# Altium schematic sheet Sheet2.SchDoc
size A4; SheetNumber: 1; SheetTotal: 1
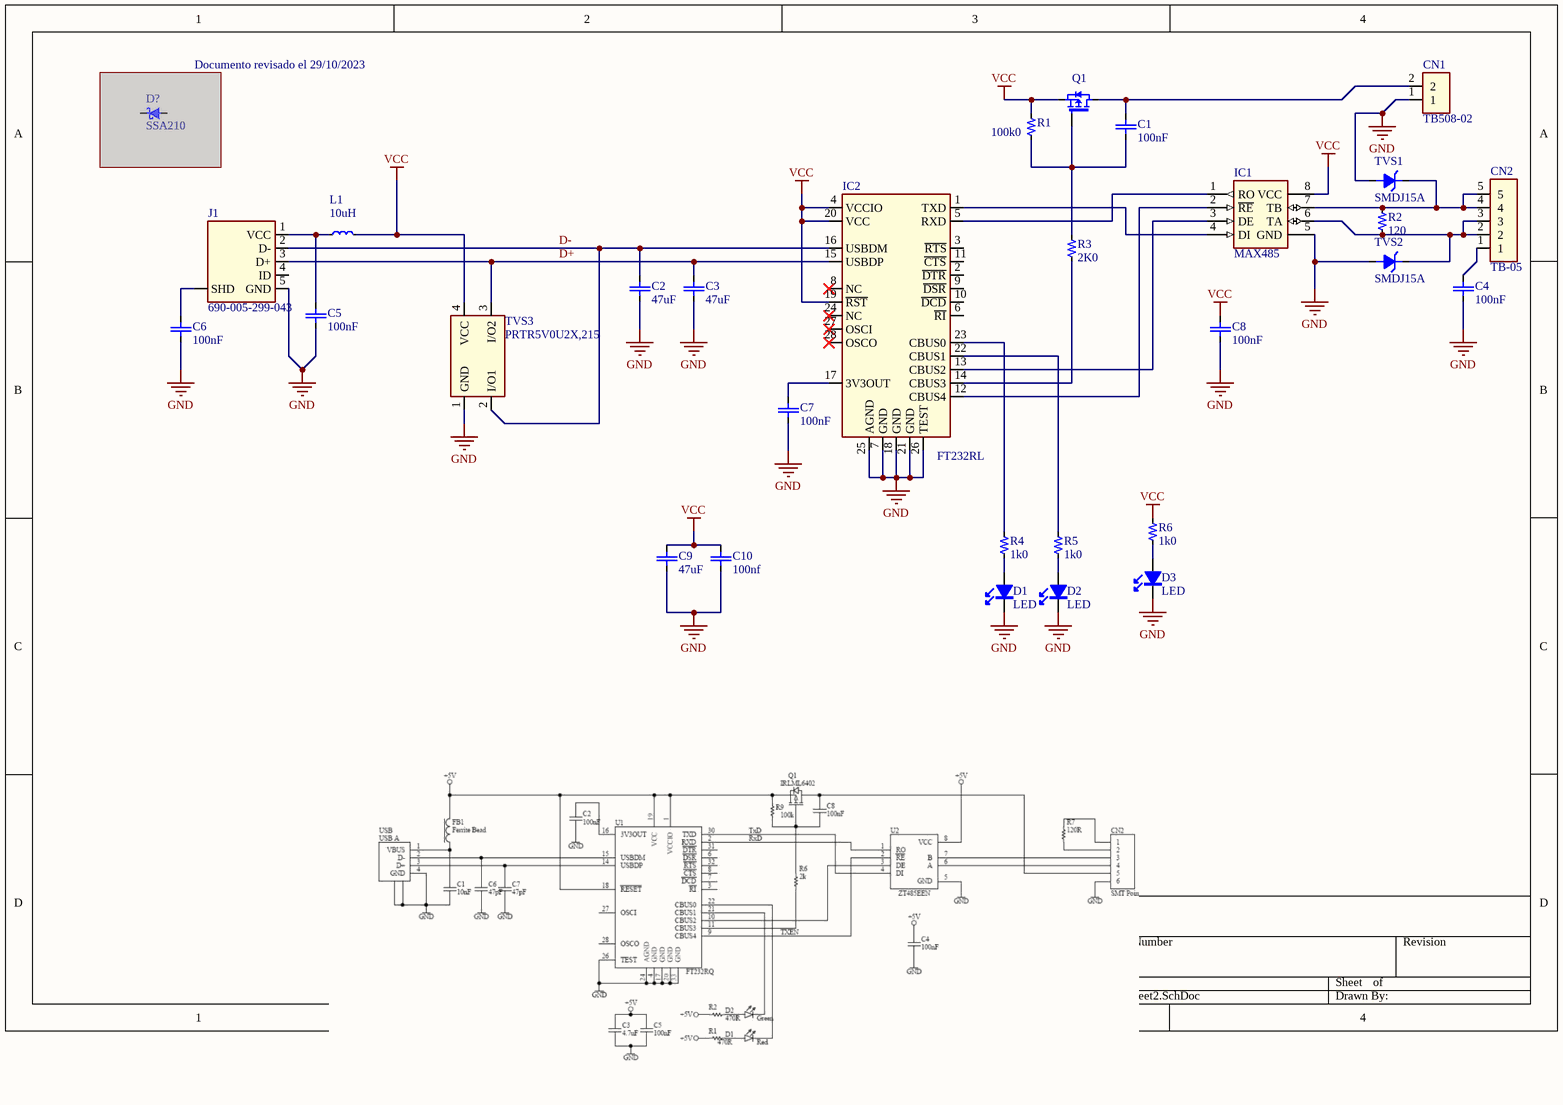
[diagram p0: Sheet2.SchDoc]

## Parts
C1  100nF  [C0805]
C2  47uF  [C0805]
C3  47uF  [C0805]
C4  100nF  [C0805]
C5  100nF  [C0805]
C6  100nF  [C0805]
C7  100nF  [C0805]
C8  100nF  [C0805]
C9  47uF  [C0805]
C10  100nf  [C0805]
CN1  TB508-02  [TB508-02]
CN2  TB-05  [TB508-05]
D1  LED  [LED-0805]
D2  LED  [LED-0805]
D3  LED  [LED-0805]
D?  SSA210  [SMB]  (masked out: inside a compile mask, not in the netlist)
IC1  MAX485  [SOIC8-N]
IC2  FT232RL  [SSOP-28]
J1  690-005-299-043  [USB-Mini]
L1  10uH  [L0805]
Q1  IRLML6402TRPBF  [SOT23-3]  (value not drawn)
R1  100k0  [R0805]
R2  120  [R0805]
R3  2K0  [R0805]
R4  1k0  [R0805]
R5  1k0  [R0805]
R6  1k0  [R0805]
TVS1  SMDJ15A  [SMC]
TVS2  SMDJ15A  [SMC]
TVS3  PRTR5V0U2X,215  [SOT143-4]

## Nets
GND: C2.1 C3.1 C4.1 C5.1 C6.1 C7.1 C8.1 C9.1 C10.1 CN1.1 D1.1 D2.1 D3.1 IC1.5(GND) IC2.7(GND) IC2.18(GND) IC2.21(GND) IC2.25(AGND) IC2.26(TEST) J1.5(GND) TVS1.2 TVS2.2 TVS3.1(GND)
VCC: C8.2 C9.2 C10.2 IC1.8(VCC) IC2.4(VCCIO) IC2.19(~{RST}) IC2.20(VCC) L1.2 Q1.2(S) R1.2 R6.2 TVS3.4(VCC)
D+: C3.2 IC2.15(USBDP) J1.3(D+) TVS3.3(I/O2)
D-: C2.2 IC2.16(USBDM) J1.2(D-) TVS3.2(I/O1)
NetC1_1: C1.1 Q1.1(G) R1.1 R3.2
NetC1_2: C1.2 CN1.2 Q1.3(D)
NetC4_2: C4.2 CN2.1
NetC5_2: C5.2 J1.1(VCC) L1.1
NetC6_2: C6.2 J1.SHD
NetC7_2: C7.2 IC2.17(3V3OUT)
NetCN2_2: CN2.2 CN2.3 IC1.6(TA) R2.1 TVS2.1
NetCN2_4: CN2.4 CN2.5 IC1.7(TB) R2.2 TVS1.1
NetD1_2: D1.2 R4.1
NetD2_2: D2.2 R5.1
NetD3_2: D3.2 R6.1
NetIC1_1: IC1.1(RO) IC2.5(RXD)
NetIC1_2: IC1.2(~{RE}) IC2.12(CBUS4)
NetIC1_3: IC1.3(DE) IC2.13(CBUS2)
NetIC1_4: IC1.4(DI) IC2.1(TXD)
NetIC2_14: IC2.14(CBUS3) R3.1
NetIC2_22: IC2.22(CBUS1) R5.2
NetIC2_23: IC2.23(CBUS0) R4.2

Not connected (* = marked no-connect by the designer): IC2 2(~{DTR}) 3(~{RTS}) 6(~{RI}) 8(NC)* 9(~{DSR}) 10(~{DCD}) 11(~{CTS}) 24(NC)* 27(OSCI)* 28(OSCO)*; J1 4(ID)

## Notes on the sheet
- (near D?) Documento revisado el 29/10/2023

## Library data of the parts
C1 C4-C8 C10 = Capacitor: Capacitor without polarity; Voltage: 25V; Part number: *; Manufacturer: *; Unit price: *; Value: 100nF
C2 C3 C9 = Capacitor: Capacitor without polarity; Value: 100nF; Voltage: 25V; Part number: *; Manufacturer: *; Unit price: *
CN1 = TB-02: Terminal Block; Manufacturer: *; Part number: *; Unit price: *; Value: TB508-02
CN2 = TB-05: Terminal Block; Manufacturer: *; Part number: *; Unit price: *; Value: TB-05
D1-D3 = LED: LED - Light-Emitting Diode; Manufacturer: *; Part number: *; Unit price: *; Value: LED
D? = Diode Schottky: Manufacturer: *; Part number: *; Value: SSA210; Unit price: 0.4
IC1 = MAX485: IC TRANSCEIVER HALF 1/1 8SOIC; Manufacturer: *; Part number: *; Unit price: *; Value: MAX485
IC2 = FT232: USB Bridge, USB to UART USB 2.0 UART Interface 28-SSOP; Value: FT232RL; Manufacturer: *; Part number: *; Unit price: *
J1 = USB-Mini-B: CONN RCPT USB2.0 MINI B SMD R/A; Manufacturer: *; Part number: *; Unit price: *; Value: 690-005-299-043
L1 = Inductor: Inductor for low power; Max. current: 0.5A; Core type: Ferrite; Manufacturer: *; Part number: *; Value: 10uH; Unit price: 0.1
Q1 = MOSFET-P-LP: P-Channel 20V 3.7A (Ta) 1.3W (Ta) /SOT-23 - LowPower; Part number: *; Manufacturer: *; Unit price: *; Value: IRLML6402TRPBF
R1-R3 = Resistor: Single resistor; Value: 1k0; Power: 0.125W; Manufacturer: *; Part number: *; Unit price: 0.1
R4-R6 = Resistor: Single resistor; Power: 0.125W; Manufacturer: *; Part number: *; Value: 1k0; Unit price: 0.1
TVS1 TVS2 = TVS-SINGLE: TVS DIODE - Transient Voltage Suppression Diode; Part number: *; Manufacturer: *; Decription: *; Unit price: *; Value: SMDJ15A
TVS3 = TVS-DUAL-SOT143B: Clamp  Ipp Tvs Diode Surface Mount SOT-143B; Part number: *; Manufacturer: *; Decription: *; Unit price: *; Value: PRTR5V0U2X,215